# EAGLE design Adafruit CH334F Mini 4-Port USB Hub Breakout (EAGLE 9.6.2)
COMPANY: ADAFRUIT INDUSTRIES; DRAWN: KTOWN; REV: A; YEAR: 2019
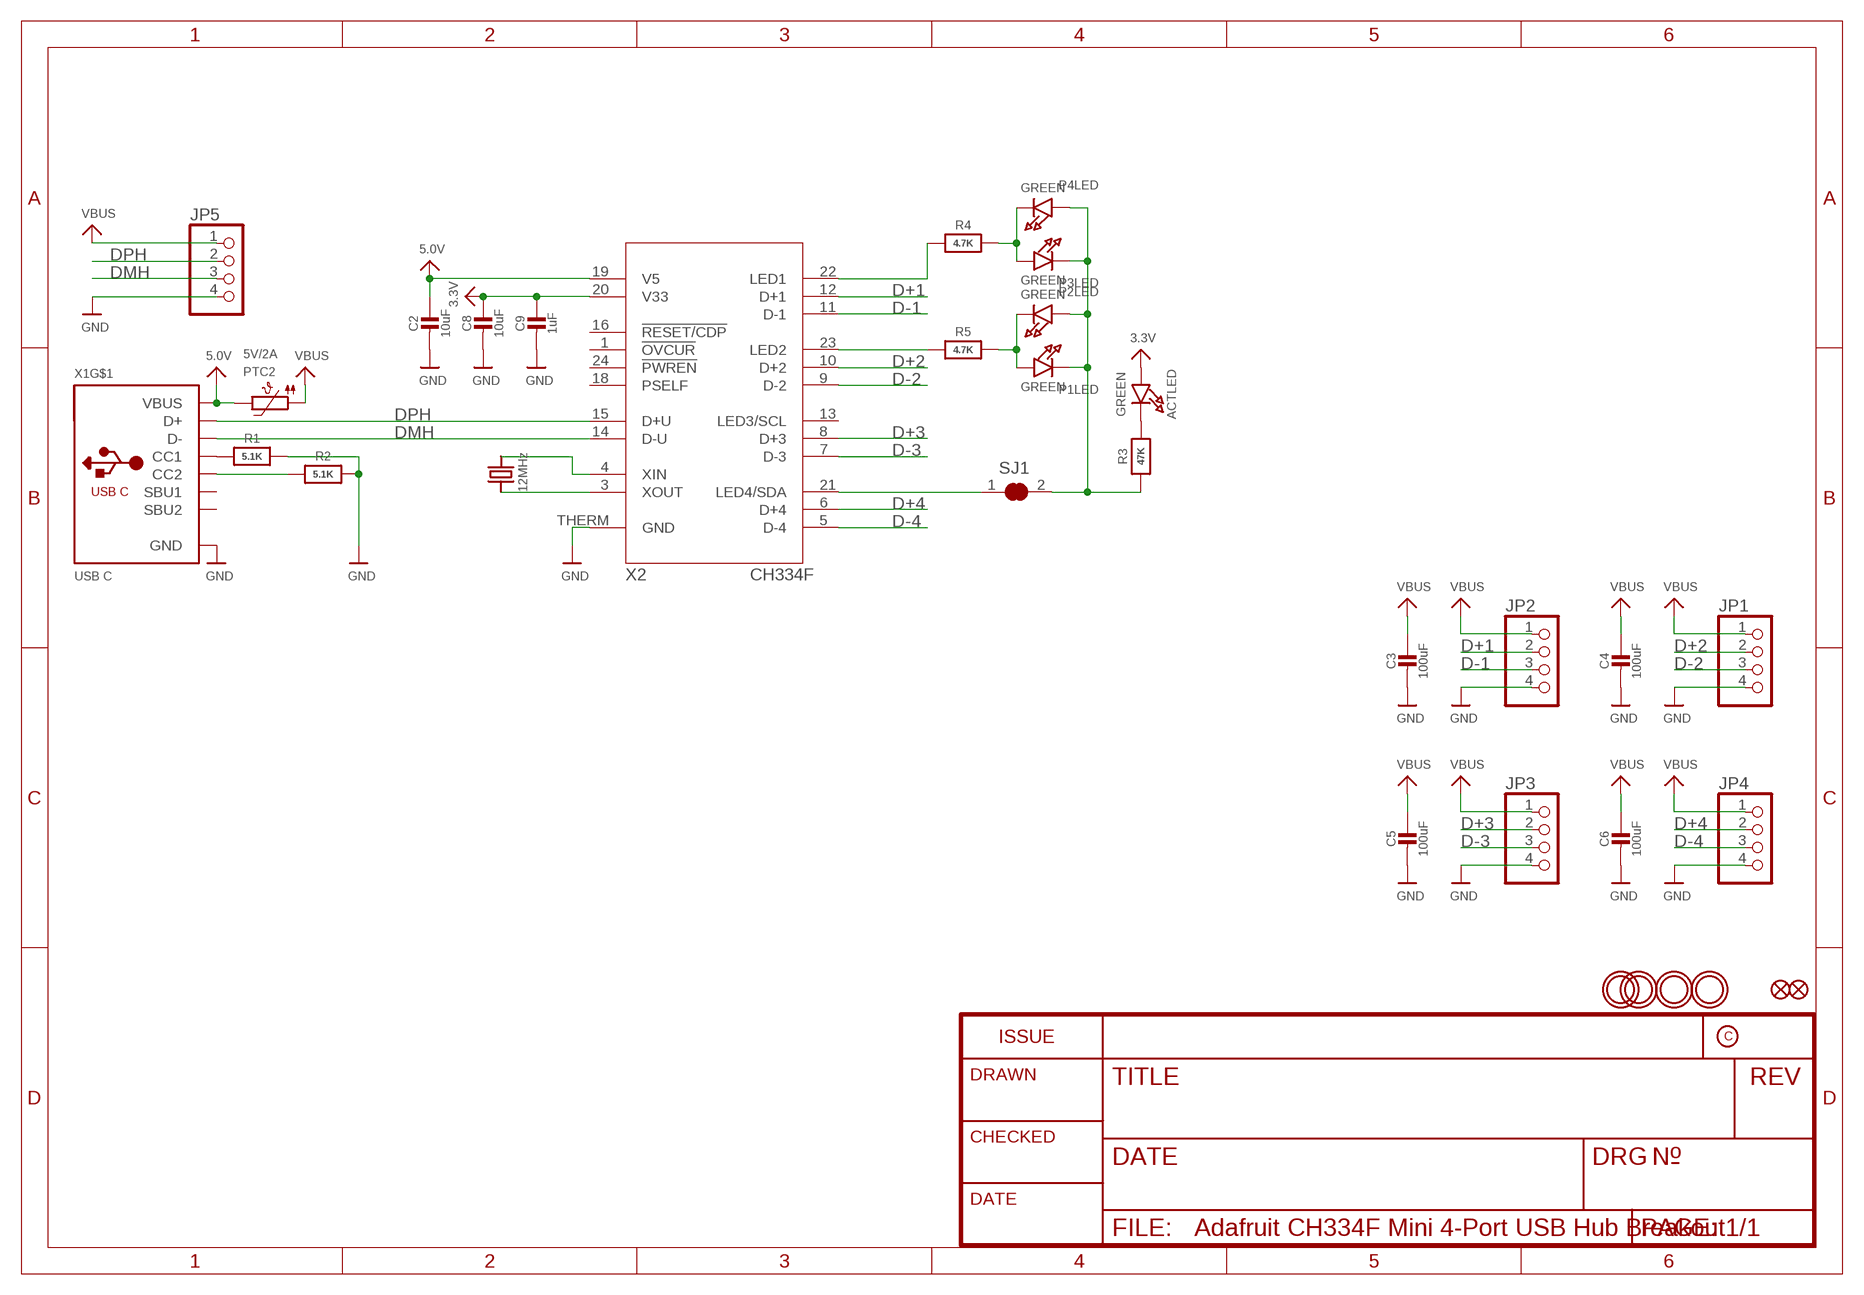
[diagram p0: schematic, sheet 1]

## Parts
ACTLED  GREEN  LED0603_NOOUTLINE  [CHIPLED_0603_NOOUTLINE]
C2  10uF  CAP_CERAMIC0805-NOOUTLINE  [0805-NO]
C3  100uF  CAP_CERAMIC_1206  [_1206]
C4  100uF  CAP_CERAMIC_1206  [_1206]
C5  100uF  CAP_CERAMIC_1206  [_1206]
C6  100uF  CAP_CERAMIC_1206  [_1206]
C8  10uF  CAP_CERAMIC0805-NOOUTLINE  [0805-NO]
C9  1uF  CAP_CERAMIC0603_NO  [0603-NO]
FID1  FIDUCIAL_0.5MM  [FIDUCIAL_0.5MM]
FID2  FIDUCIAL_0.5MM  [FIDUCIAL_0.5MM]
JP1  HEADER-1X4ROUND  [1X04_ROUND]
JP2  HEADER-1X4ROUND  [1X04_ROUND]
JP3  HEADER-1X4ROUND  [1X04_ROUND]
JP4  HEADER-1X4ROUND  [1X04_ROUND]
JP5  HEADER-1X4ROUND  [1X04_ROUND]
P1LED  GREEN  LED0603_NOOUTLINE  [CHIPLED_0603_NOOUTLINE]
P2LED  GREEN  LED0603_NOOUTLINE  [CHIPLED_0603_NOOUTLINE]
P3LED  GREEN  LED0603_NOOUTLINE  [CHIPLED_0603_NOOUTLINE]
P4LED  GREEN  LED0603_NOOUTLINE  [CHIPLED_0603_NOOUTLINE]
PTC2  5V/2A  PTC_0805  [0805-NO]
R1  5.1K  RESISTOR_0603_NOOUT  [0603-NO]
R2  5.1K  RESISTOR_0603_NOOUT  [0603-NO]
R3  47K  RESISTOR_0603_NOOUT  [0603-NO]
R4  4.7K  RESISTOR_0603_NOOUT  [0603-NO]
R5  4.7K  RESISTOR_0603_NOOUT  [0603-NO]
SJ1  SOLDERJUMPER_CLOSED  [SOLDERJUMPER_CLOSEDWIRE]
U$23  MOUNTINGHOLE2.5  [MOUNTINGHOLE_2.5_PLATED]
U$28  MOUNTINGHOLE2.5  [MOUNTINGHOLE_2.5_PLATED]
U$29  MOUNTINGHOLE2.5  [MOUNTINGHOLE_2.5_PLATED]
U$31  MOUNTINGHOLE2.5  [MOUNTINGHOLE_2.5_PLATED]
X1  USB C  USB_C  [USB_C_CUSB31-CFM2AX-01-X]
X2  CH334F  [QFN24_4MM]
Y1  12MHz  CRYSTAL2.5X2.0  [CRYSTAL_2.5X2]

## Nets
3.3V: ACTLED.A C8.1 C9.1 X2.20(V33)
5.0V: C2.1 PTC2.2 X1.A4B9(VBUS) X1.B4A9(VBUS) X2.19(V5)
D+1: JP2.2 X2.12(D+1)
D+2: JP1.2 X2.10(D+2)
D+3: JP3.2 X2.8(D+3)
D+4: JP4.2 X2.6(D+4)
D-1: JP2.3 X2.11(D-1)
D-2: JP1.3 X2.9(D-2)
D-3: JP3.3 X2.7(D-3)
D-4: JP4.3 X2.5(D-4)
DMH: JP5.3 X1.A7(D-) X1.B7(D-) X2.14(D-U)
DPH: JP5.2 X1.A6(D+) X1.B6(D+) X2.15(D+U)
GND: C2.2 C3.2 C4.2 C5.2 C6.2 C8.2 C9.2 JP1.4 JP2.4 JP3.4 JP4.4 JP5.4 R1.2 R2.2 X1.A1B12(GND) X1.B1A12(GND) X2.THERM(GND)
N$1: R1.1 X1.A5(CC1)
N$2: R2.1 X1.B5(CC2)
N$3: X2.3(XOUT) Y1.1
N$4: X2.4(XIN) Y1.3
N$5: ACTLED.C R3.2
N$6: P1LED.C P2LED.A P3LED.C P4LED.A R3.1 SJ1.2
N$7: P3LED.A P4LED.C R4.2
N$8: R4.1 X2.22(LED1)
N$9: SJ1.1 X2.21(LED4/SDA)
N$10: P1LED.A P2LED.C R5.2
N$12: R5.1 X2.23(LED2)
VBUS: C3.1 C4.1 C5.1 C6.1 JP1.1 JP2.1 JP3.1 JP4.1 JP5.1 PTC2.1
Unconnected: X1.A8(SBU1) X1.B8(SBU2) X1.M1(MT) X1.M2(MT) X1.M3(MT) X1.M4(MT) X2.1(!OVCUR) X2.13(LED3/SCL) X2.16(!RESET/CDP) X2.18(PSELF) X2.24(!PWREN)

## Library data of the parts
ACTLED P1LED P2LED P3LED P4LED = microbuilder:LED: LED 0603 - 0603 Surface Mount Package 2mA: Green LED - Low Power (3.9mcd, 2ma, 1.7Vf) - Digikey: 475-2709-2-ND Orange LED - Low Power (9.8mcd, 2ma, 1.8Vf) - Digikey: 475-1194-2-ND Red LED - Low Power (5mcd, 2ma, 1.8Vf) - Digikey: 475-1195-2-ND Yellow LED - Low Power (7mcd, 2ma, 1.8Vf) - Digikey: 475-1196-2-ND 5mA: Blue LED - Low Power (17mcd, 5ma, 2.9Vf) - Digikey: LNJ937W8CRACT-ND 0805 - 0805 Surface Mount Package 2mA: Red LED (8.8mcd, 2mA, 1.8Vf, Clear) - Low Power [Digikey: 475-2510-1-ND] Green LED (5mcd, 2mA, 1.8Vf, Clear) - Low Power [Digikey: 475-2730-1-ND] Yellow LED (11.3mcd, 2mA, 1.8Vf, Clear) - Low Power [Digikey: 475-2555-1-ND] 20mA: Red LED (104mcd, 20mA, Diffused) - LS R976 [Digikey: 475-1278-6-ND] Red LED (12mcd, 20mA, 2.0Vf, Clear) - APT2012EC [Digikey: 754-1128-1-ND] Green LED (15mcd, 20mA, 2.2Vf, Clear) - APT2012GC [Digikey: 754-1131-1-ND] Orange LED (160mcd, 20mA, 2.1Vf, Clear) - APT2012SECK [Digikey: 754-1130-1-ND] 1206 - 1206 Surface Mount Package Green LED (26mcd, 20mA, Diffused) - LG N971 [Digikey: 475-1407-6-ND] Red LED (15mcd, 20mA, Diffused) - LH N974 [Digikey: 475-1416-6-ND] Cree - Cree High-Power Surface Mount LEDs XPEBWT-L1-0000-00D50 - White 111lm 350mA 2.9Vf 6200K 110° XTEAWT-00-0000-00000LEE3 - White 114lm 350mA 2.85Vf 5000K 115° Everlight - Everlight 45-21 Series Surface Mount LEDs 45-21/QK2C-B2832AC2CB2/2T - Warm White 2000mcd 20mA 3.25Vf 3050K 120° 45-21/LK2C-B38452C4CB2/2T - Nuetral White 2000mcd 20mA 3.25Vf 4150K 120° 45-21/LK2C-B50634C6CB2/2T - Cold White 2200mcd 20mA 3.25Vf 5650K 120° PLCC2 Reverse Mount LS T77K-J1L2-1-0-2-R18-Z - Red 11.25mcd 2mA 1.8Vf 630nm 120° LO T77K-L1M2-24-Z - Orange 19.6mcd 2mA 1.8Vf 606nm 120° LY T77K-K2M1-26-Z - Yellow 15.7mcd 2mA 1.8Vf 587nm 120°; ROT: 270
C2-C6 C8 C9 = microbuilder:CAP_CERAMIC: Ceramic Capacitors For new designs, use the packages preceded by an '_' character since they are more reliable: The following footprints should be used on most boards: _0402 - Standard footprint for regular board layouts _0603 - Standard footprint for regular board layouts _0805 - Standard footprint for regular board layouts _1206 - Standard footprint for regular board layouts For extremely tight-pitch boards where space is at a premium, the following 'micro-pitch' footprints can be used (smaller pads, no silkscreen outline, etc.): _0402MP - Micro-pitch footprint for very dense/compact boards _0603MP - Micro-pitch footprint for very dense/compact boards _0805MP - Micro-pitch footprint for very dense/compact boards _1206MP - Micro-pitch footprint for very dense/compact boards
FID1 FID2 = microbuilder:FIDUCIAL: Fiducial Alignment Points Various fiducial points for machine vision alignment.
JP1-JP5 = microbuilder:HEADER-1X4: PIN HEADER
PTC2 = microbuilder:PTC: PTC (Resettable Fuse) 1206 Package 250mA PTC (16V Max, Time-to-Trip: 0.08s) - Digikey: F2110CT-ND 1210 Package 100mA PTC (30V Max, Time-to-Trip: 0.6s) - Digikey: MF-USMF010-2CT-ND 1812 Package 750mA PTC (24V Max, Time-to-Trip: 0.2s) - Digikey: MF-MSMF075/24-2CT-ND
R1-R5 = microbuilder:RESISTOR: Resistors For new designs, use the packages preceded by an '_' character since they are more reliable: The following footprints should be used on most boards: _0402 - Standard footprint for regular board layouts _0603 - Standard footprint for regular board layouts _0805 - Standard footprint for regular board layouts _1206 - Standard footprint for regular board layouts For extremely tight-pitch boards where space is at a premium, the following 'micro-pitch' footprints can be used (smaller pads, no silkscreen outline, etc.): _0402MP - Micro-pitch footprint for very dense/compact boards _0603MP - Micro-pitch footprint for very dense/compact boards _0805MP - Micro-pitch footprint for very dense/compact boards _1206MP - Micro-pitch footprint for very dense/compact boards
SJ1 = microbuilder:SOLDERJUMPER_CLOSED: Solder Jumper - Closed These solder jumpers are closed by default CLOSEDWIRE - 10 mil trace between pads that can be cut and resoldered later CLOSEDPERM - 63 mil trace between pads for a permanent connection (used to 'bridge' two signals, a shameless hack for Eagle). Can double as a test point as well (no cream layer)
U$23 U$28 U$29 U$31 = microbuilder:MOUNTINGHOLE: Mounting Hole For #2 screws (0.086"/2.18mm width, 0.094"/2.4mm hole) use 2.5mm; BOM: EXCLUDE
X1 = adafruit_electromech:USB_C: USB Type-C USB 2.0 Connector; LCSC: C165948
X2 = adafruit_micro:CH334F
Y1 = microbuilder:CRYSTAL: Crystals HC49UP - Surface Mount Crystal 4.0MHz 18pF +/-30ppm Surface Mount Crystal [Digikey: 535-9857-1-ND] 12.0 MHz Surface Mount Crystal [Digikey: 535-9869-6-ND] 25.0 MHz Surface Mount Crystal [Digikey: 535-9078-1-ND] 2.5 x 2.0mm - MEMs SMT Crystal 16.0 MHz 10pF 20ppm 2.5 x 2.0mm Crystal [Digikey -40-85°C: 535-10923-1-ND] 3.2 x 2.5mm - MEMs SMT Crystal 12.0 MHz 8pF 15ppm 3.2 x 2.5mm Crystal [Digikey: -10-70°C: 644-1047-1-ND -40-125°C: 644-1128-1-ND] 40~85°C cheaper: 644-1173-6-ND 16.0 MHz 8pF 15ppm 3.2 x 2.5mm Crystal [Digikey: -10-70°C: 644-1049-1-ND -40-125°C: 644-1129-2-ND]-40~85°C cheaper: 644-1175-6-ND 16.0 MHz 10pF 10ppm 3.2 x 2.5mm Crystal [Digikey: 644-1100-1-ND] 27.12 MHz 18pF 30ppm 3.2 x 2.5mm Crystal [Digikey: 887-1424-1-ND] 27.12MHz 10pF 10ppm 3.2 x 2.5mm Crystal [Digikey: 887-1329-1-ND] 4.9 x 1.8mm - MEMs SMT Crystal 32.768 KHz 12.5pF 20ppm 4.9 x 1.8mm Crystal [Digikey: SE2415CT-ND] 8.0 x 3.8mm - Surface Mount Crystal 32.768kHz 12.5pF 20ppm -40°C-85°C [Digikey: 535-9166-2-ND] Cylinder 32.768KHz Cylinder Crystal (2x6mm body) [Ex. Digikey: 300-8341-2-ND]

## Board
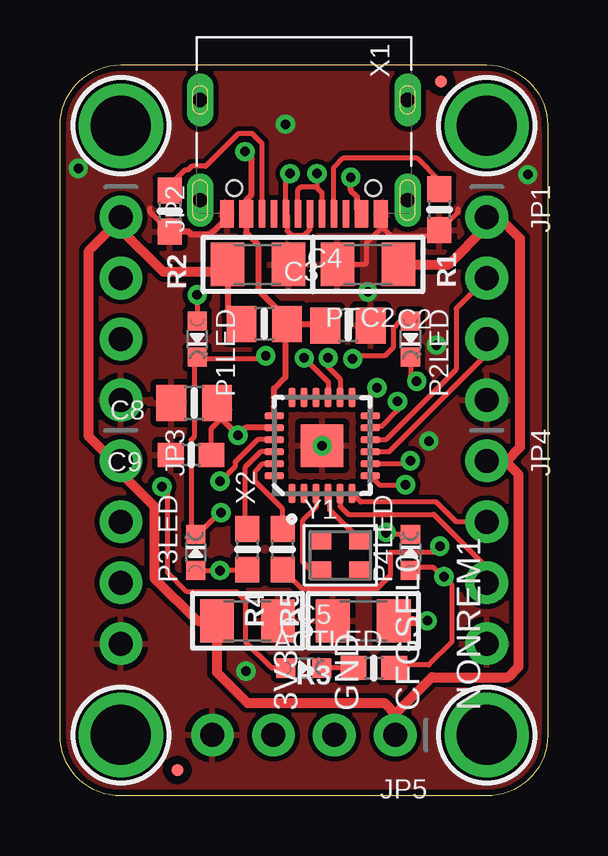
[diagram p1: board, top side]
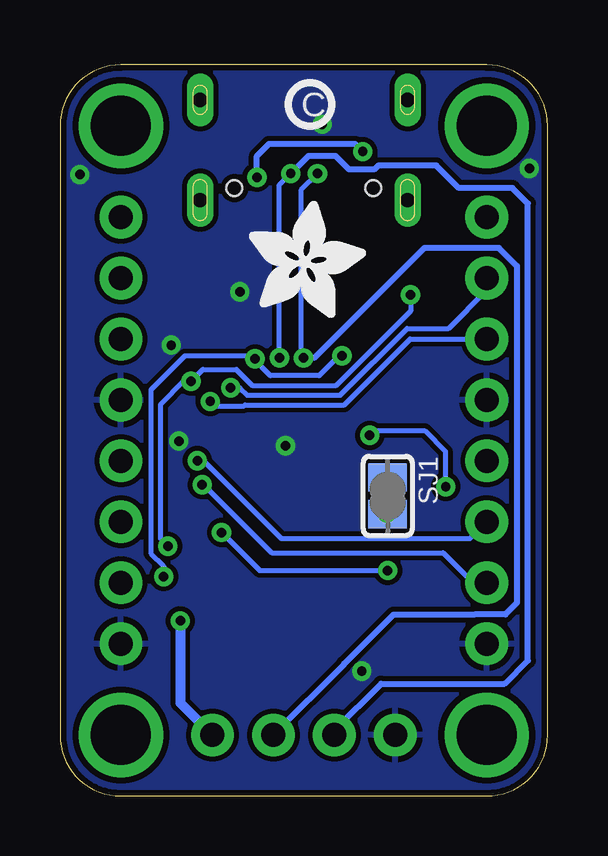
[diagram p2: board, bottom side, seen from below]

Size 20.32 x 30.48 mm. Coordinates in mm from the lower left corner, seen from the top.
Outline: 20.32,27.94 20.32,2.54 arc-90 17.78,0 2.54,0 arc-90 0,2.54 0,27.94 arc-90 2.54,30.48 17.78,30.48 arc-90 20.32,27.94
Copper layers (1*16): Top 0.035mm / dielectric 1.5mm / Bottom 0.035mm
Design rules "adafruit": minimum track width 8mil, minimum drill 15.5mil, track to track 8mil, track to pad 8mil, pad to pad 8mil, via to via 8mil, smd to smd 8mil, copper to edge 10mil, drill to drill 8mil, minimum pad ring 10mil, minimum via ring 8mil, stop-mask expansion 2mil, vias tented up to drill 20mil, thermal gap 10mil

### Footprints (pad centres in the part's own frame; a part is rotated, then mirrored left to right if it is on the bottom)
CHIPLED_0603_NOOUTLINE = smd 0.8 x 0.8: A 0,-0.75; C 0,0.75
0805-NO = smd 1.24 x 1.5: 1 -0.95,0; 2 0.95,0
_1206 = smd 1.4 x 1.8: 1 -1.27,0; 2 1.27,0
0603-NO = smd 1.075 x 1: 1 -0.85,0; 2 0.85,0
FIDUCIAL_0.5MM = smd 0.5 x 0.5: 1 0,0
1X04_ROUND = drill 1 pad 1.778: 1 -3.81,0; 2 -1.27,0; 3 1.27,0; 4 3.81,0
SOLDERJUMPER_CLOSEDWIRE = smd 1.168 x 1.6: 1 -0.762,0; 2 0.762,0 | smd 0.635 x 0.203: WIRE 0,0
MOUNTINGHOLE_2.5_PLATED = drill 2.5 pad 3.2: P$1 0,0
USB_C_CUSB31-CFM2AX-01-X = smd 0.575 x 1.15: A1B12 -3.2,2.275; A4B9 -2.4,2.275; B1A12 3.2,2.275; B4A9 2.4,2.275 | smd 0.275 x 1.15: A5 -1.25,2.275; A6 -0.25,2.275; A7 0.25,2.275; A8 1.25,2.275; B5 1.75,2.275; B6 0.75,2.275; B7 -0.75,2.275; B8 -1.75,2.275 | drill 0.6 pad 1 long: M1 -4.32,1.7; M2 4.32,1.7; M3 -4.32,-2.48; M4 4.32,-2.48 | hole 0.65: 2.89,1.2; -2.89,1.2
QFN24_4MM = smd 0.8 x 0.28: 1 -2,1.25; 2 -2,0.75; 3 -2,0.25; 4 -2,-0.25; 5 -2,-0.75; 6 -2,-1.25; 13 2,-1.25; 14 2,-0.75; 15 2,-0.25; 16 2,0.25; 17 2,0.75; 18 2,1.25 | smd 0.28 x 0.8: 7 -1.25,-2; 8 -0.75,-2; 9 -0.25,-2; 10 0.25,-2; 11 0.75,-2; 12 1.25,-2; 19 1.25,2; 20 0.75,2; 21 0.25,2; 22 -0.25,2; 23 -0.75,2; 24 -1.25,2 | smd 1.778 x 1.778: THERM 0,0
CRYSTAL_2.5X2 = smd 0.9 x 0.75: 1 -0.825,-0.625; 2 0.825,-0.625; 3 0.825,0.625; 4 -0.825,0.625

### Placement (x,y rotation side)
ACTLED  10.16,5.33 270 top
C2  12,19.62 0 top
C3  12.83,22.16 180 top
C4  8.26,22.16 0 top
C5  7.81,7.3 0 top
C6  12.64,7.3 180 top
C8  5.59,16.38 180 top
C9  5.46,14.22 180 top
FID1  4.89,1.08 180 top
FID2  15.88,29.78 180 top
JP1  17.78,20.32 270 top
JP2  2.54,20.32 270 top
JP3  2.54,10.16 270 top
JP4  17.78,10.16 270 top
JP5  10.16,2.54 180 top
P1LED  5.71,19.05 180 top
P2LED  14.61,19.05 180 top
P3LED  5.65,10.16 0 top
P4LED  14.61,10.16 0 top
PLABEL0  [PLABEL0]  0.89,16.64 90 top
PLABEL1  [PLABEL1]  19.43,16.57 90 top
PLABEL2  [PLABEL2]  19.43,6.1 90 top
PLABEL3  [PLABEL3]  19.43,22.03 90 top
PLABEL4  [PLABEL4]  19.43,11.62 90 top
PLABEL5  [PLABEL5]  0.89,21.84 90 top
PLABEL6  [PLABEL6]  0.89,19.3 90 top
PLABEL7  [PLABEL7]  0.89,24.26 90 top
PLABEL8  [PLABEL8]  19.43,19.3 90 top
PLABEL9  [PLABEL9]  10.29,0.89 0 top
PLABEL10  [PLABEL10]  19.43,9.02 90 top
PLABEL11  [PLABEL11]  19.43,24.57 90 top
PLABEL12  [PLABEL12]  19.43,13.78 90 top
PLABEL13  [PLABEL13]  16,20.19 90 top
PLABEL14  [PLABEL14]  16,10.16 90 top
PLABEL15  [PLABEL15]  0.89,6.03 90 top
PLABEL16  [PLABEL16]  0.89,11.75 90 top
PLABEL17  [PLABEL17]  0.89,9.08 90 top
PLABEL18  [PLABEL18]  0.89,13.84 90 top
PLABEL19  [PLABEL19]  4.45,20.32 90 top
PLABEL20  [PLABEL20]  4.45,10.03 90 top
PLABEL21  [PLABEL21]  6.16,4.13 0 top
PLABEL22  [PLABEL22]  11.56,4.13 0 top
PLABEL23  [PLABEL23]  8.95,4.13 0 top
PLABEL24  [PLABEL24]  13.84,4.13 0 top
PLABEL25  [PLABEL25]  10.16,7.62 0 bottom
PLABEL26  [PLABEL26]  10.1,16.7 0 bottom
PLABEL27  [PLABEL27]  19.49,20.32 90 bottom
PLABEL28  [PLABEL28]  19.49,10.16 90 bottom
PLABEL29  [PLABEL29]  0.83,10.16 90 bottom
PLABEL30  [PLABEL30]  0.83,20.32 90 bottom
PLABEL31  [PLABEL31]  8.51,12.64 90 bottom
PLABEL32  [PLABEL32]  10.16,0.89 0 bottom
PTC2  8.51,19.68 0 top
R1  15.81,24.45 270 top
R2  4.57,24.38 270 top
R3  13.08,5.33 180 top
R4  7.81,10.29 270 top
R5  9.27,10.29 270 top
SJ1  6.67,12.51 270 bottom
U$23  17.78,2.54 180 top
U$28  2.54,27.94 0 top
U$29  17.78,27.94 0 top
U$31  2.54,2.54 180 top
U$33  [ADAFRUIT_5MM]  12.45,19.94 0 bottom
U$34  [PCBFEAT-REV-040]  9.91,28.83 0 bottom
X1  10.16,26.54 180 top
X2  10.92,14.61 90 top
Y1  11.68,10.03 0 top

### Tracks (layer width: path | path; a pad name or v marks a point on that pad's centre or on a via)
3.3V  (via drill 0.39)
  Top 0.203: 6.95,15.97 C8.1 | C9.1 6.31,15.33 6.95,15.97 | 6.95,15.97 7.08,16.1 | ACTLED.A 8.83,5.33 7.75,6.41 7.75,8.13 7.37,8.51 5.29,8.51 4.49,9.31 4.49,12.73 4.33,12.89 v4.25,12.89
  Top 0.254: X2.20 7.74,15.36 v7.42,15.04 6.54,15.92 C8.1
  Bottom 0.203: v7.42,15.04 7.23,15.23 5.13,15.23 4.25,14.35 v4.25,12.89
5.0V  (via drill 0.39)
  Top 0.254: X2.19 8.92,16.99 9.4,17.46 9.4,19.62 PTC2.2 | X1.A4B9 12.38,24.45 12.38,24.98 12.12,25.24 v12.12,25.79 | v7.71,26.86 7.98,26.59 7.98,25.05 7.76,24.84 X1.B4A9 7.76,23.48 8.26,22.99 8.26,21.08 9.46,19.88 PTC2.2 | PTC2.2 10.99,19.68 C2.1
  Bottom 0.254: v12.12,25.79 12.12,26.68 11.61,27.19 8.03,27.19 v7.71,26.86
D+1  (via drill 0.39)
  Top 0.203: v13.21,17.02 12.92,16.73 X2.12
  Bottom 0.203: v13.21,17.02 12.83,17.02 12.52,16.71 8.64,16.71 5.86,19.49 4.13,19.49 2.54,21.08 JP2.2 2.54,21.46
D+2
  Top 0.203: X2.10 13.59,14.86 16.51,17.78 16.51,20.32 JP1.2
D+3  (via drill 0.39)
  Top 0.203: X2.8 14.47,13.86 v14.6,13.98
  Bottom 0.203: v14.6,13.98 14.47,14.11 11.09,10.73 3.24,10.73 JP3.2
D+4
  Top 0.203: X2.6 12.52,12.26 15.68,12.26 16.51,11.43 JP4.2
D-1  (via drill 0.39)
  Top 0.203: X2.11 12.98,15.41 13.41,15.41 14.06,16.06 v14.06,16.45
  Bottom 0.203: 13.82,16.25 14.02,16.45 v14.06,16.45 13.86,16.25 12.68,16.25 12.62,16.31 8.47,16.31 5.73,19.05 JP2.3 2.56,19.02
D-2
  Top 0.203: X2.9 13.72,14.36 17.78,18.41 JP1.3
D-3  (via drill 0.39)
  Top 0.203: X2.7 13.3,12.98 v14.4,12.98
  Bottom 0.203: v14.4,12.98 14.34,12.98 11.49,10.13 4.36,10.13 3.11,8.89 JP3.3
D-4
  Top 0.203: X2.5 11.67,12.08 12,11.75 15.57,11.75 17.78,9.54 JP4.3
DMH  (via drill 0.39)
  Top 0.203: X1.A7 9.91,25.28 10.03,25.4 10.67,25.4 10.71,25.36 | X1.B7 10.91,25.16 10.71,25.36 | v11.18,18.27 11.18,17.89 11.67,17.39 X2.14 | v10.71,25.95 10.71,25.36
  Bottom 0.203: v11.18,18.27 11.18,25.48 v10.71,25.95
  Bottom 0.254: JP5.3 8.89,2.73 6.94,4.68 1.79,4.68 0.83,5.65 0.83,24.7 1.47,25.35 3.7,25.35 4.64,26.29 7.06,26.29 7.23,26.11 8.27,26.11 8.84,26.68 9.97,26.68 v10.71,25.95
DPH  (via drill 0.39)
  Top 0.203: X1.A6 10.41,23.62 10.29,23.5 10.28,23.5 10.17,23.39 9.65,23.39 9.47,23.57 9.47,24.21 X1.B6 9.41,25.77 v9.59,25.95 | v10.17,18.26 11.17,17.26 X2.15
  Bottom 0.203: v9.59,25.95 10.29,25.25 10.29,18.29 10.26,18.26 v10.17,18.26
  Bottom 0.254: JP5.2 8.48,5.49 8.48,5.51 6.43,7.56 3.06,7.56 3.04,7.57 1.76,7.57 1.28,8.05 1.28,22.1 2.03,22.85 5.14,22.85 9.73,18.26 v10.17,18.26
GND  (via drill 0.39)
  Top 0.203: C3.2 12.7,22.16 12.76,22.23 12.76,23.05 13.36,23.65 X1.A1B12 13.36,23.79 13.78,23.37 15.58,23.37 R1.2 16.59,24.37 16.59,24.48 | R2.2 3.75,24.36 3.75,24.51
  Top 0.254: X1.B1A12 6.96,24.11 6.26,23.41 5.47,23.41 5.34,23.53 R2.2
  other vias: 12.83,21.02 10.92,14.61 7.75,5.21 15.37,14.8 9.4,28 0.76,26.16 19.49,25.91 15.68,18.8
  pour Top: 0,30.48 0,0 20.32,0 20.32,30.48
  pour Bottom: 0,30.48 0,0 20.32,0 20.32,30.48
N$1
  Top 0.203: X1.A5 11.41,26.21 11.81,26.61 14.86,26.61 15.81,25.65 R1.1
N$2
  Top 0.203: R2.1 4.57,25.46 5.21,26.1 5.33,26.1 5.48,26.26 6.06,26.26 7.43,27.62 8,27.62 8.41,27.21 X1.B5
N$3
  Top 0.203: X2.3 10.67,12.03 10.1,11.46 10.1,9.79 10.54,9.35 10.8,9.35 Y1.1
N$4
  Top 0.203: X2.4 11.23,12.55 11.23,11.95 Y1.3
N$5
  Top 0.203: R3.2 ACTLED.C
N$6  (via drill 0.39)
  Top 0.203: v8.57,18.35 8.45,18.22 5.79,18.22 P1LED.C 5.59,18.17 5.59,14.97 5.47,14.85 5.47,11.16 5.47,11.15 5.47,11.09 | v12.19,18.22 12.32,18.35 13.53,18.35 13.88,18.7 13.88,19.52 14.16,19.8 P2LED.A | P4LED.A 14.73,9.54 15.55,9.54 15.94,9.14 v16,9.14 16.32,8.83 16.32,6.41 15.37,5.46 14.06,5.46 R3.1 | 5.47,11.09 5.47,10.91 | 5.47,11.09 P3LED.C 5.74,10.91 6.68,11.84
  Top 0.254: v6.71,11.81 6.68,11.84
  Bottom 0.203: v8.57,18.35 8.7,18.35 9.53,17.53 11.56,17.53 12.19,18.16 v12.19,18.22 12.32,18.35 15.11,18.35 16.54,16.93 16.54,10.12 16,9.59 v16,9.14
  Bottom 0.254: SJ1.2 6.67,11.77 v6.71,11.81
N$7  (via drill 0.39)
  Top 0.203: P4LED.C 13.66,10.91 v13.59,10.99 | P3LED.A 6.66,9.41 v6.67,9.4 7.77,9.4 R4.2
  Bottom 0.203: v13.59,10.99 12,9.4 v6.67,9.4
N$8
  Top 0.203: X2.22 8.37,14.36 7.71,13.69 7.71,11.24 R4.1
N$9  (via drill 0.39)
  Top 0.203: X2.21 8.23,14.86 7.3,13.92 7.3,13.75 v6.68,13.12 v6.67,13.12
  Bottom 0.254: 6.67,13.16 SJ1.1 v6.67,13.12
N$10  (via drill 0.39)
  Top 0.203: v5.71,20.89 P1LED.A | v14.86,17.29 14.61,17.55 P2LED.C | R5.2 10.07,8.64 13.21,8.64 13.78,9.21 13.78,10.16 15.57,10.16 v15.82,10.41
  Bottom 0.203: v15.82,10.41 16.13,10.72 16.13,16.32 15.16,17.29 v14.86,17.29 14.37,17.78 12.97,17.78 12.31,17.12 8.81,17.12 5.71,20.21 v5.71,20.89
N$12
  Top 0.203: R5.1 9.27,11.96 8.13,13.11 8.13,13.53 8.46,13.86 X2.23
VBUS  (via drill 0.39)
  Top 0.254: C4.1 6.99,20.26 PTC2.1
  Top 0.406: C3.1 16.19,22.16 17.78,23.75 JP1.1 18.29,24.13 19.18,23.24 19.18,14.54 18.61,13.97 18.54,13.97 | C4.1 6.67,21.84 4.32,21.84 2.54,23.62 2.54,24.07 | 2.54,24.07 JP2.1 | JP5.1 13.97,3.43 | 13.97,3.43 13.53,3.87 7.81,3.87 6.54,5.14 C5.1 5.71,7.3 3.94,9.08 3.94,12.06 2.54,13.46 JP3.1 2.22,13.97 1.21,14.99 1.21,22.73 2.54,24.07 | 13.97,3.43 15.49,4.95 18.67,4.95 19.11,5.4 19.11,13.4 18.54,13.97 | 18.54,13.97 JP4.1 | C6.1 v15.3,7.3
  Bottom 0.406: v15.3,7.3 15.3,3.87 JP5.1

### Text on the board
tNames: 3V3 | GND | CFGSEL0 | NONREM1
Pinguin_tBackup: 5V | 5V | D+ | D+ | PORT1 | PORT2 | D- | D- | GND | GND | 5V | 5V | D+ | D+ | PORT3 | PORT4 | D- | D- | GND | GND | GND | D- | D+ | 5V | USBHOST
Pinguin_bBackup: Port2 | Port1 | CH334F | LEDs | Port4 | Port3 | Mini USB / 4-Port Hub | Host Port